# EAGLE design BOTTOM_pcb_redonda (EAGLE 9.6.2)
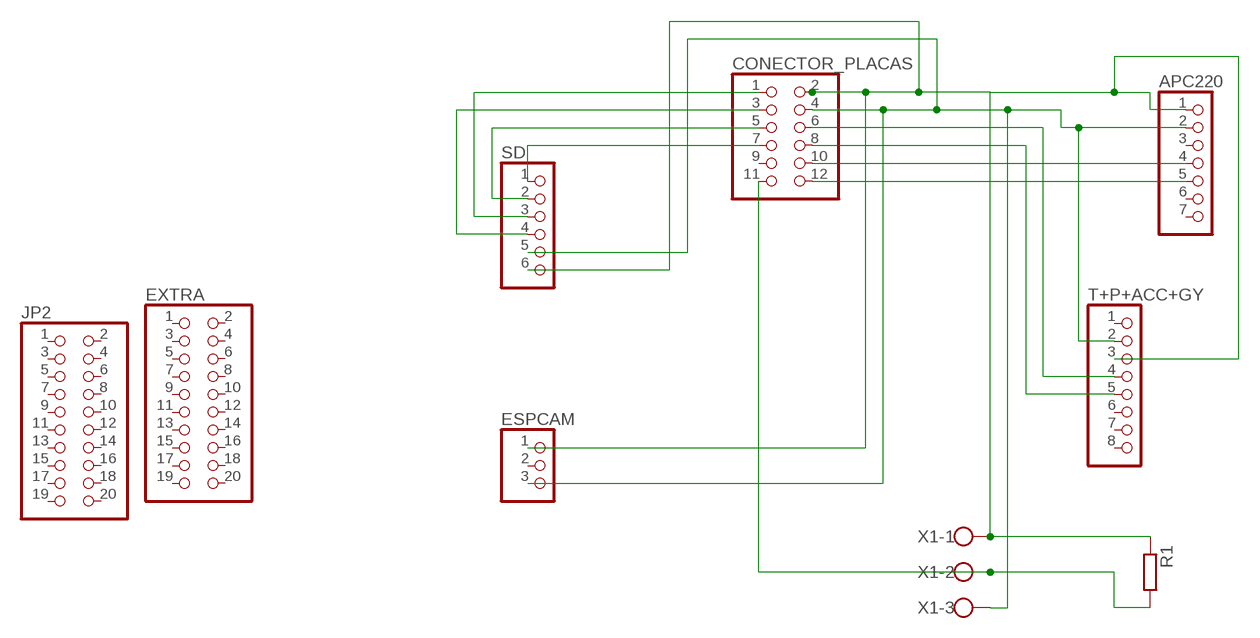
[diagram p0: schematic, sheet 1]

## Parts
APC220  PINHD-1X7  [1X07]
CONECTOR_PLACAS  PINHD-2X6  [2X06]
ESPCAM  PINHD-1X3  [1X03]
EXTRA  PINHD-2X10  [2X10]
JP2  PINHD-2X10  [2X10]
R1  R-EU_0207/10  [0207/10]
SD  PINHD-1X6  [1X06]
T+P+ACC+GY  PINHD-1X8  [1X08]
X1  W237-103  [W237-103]

## Nets
N$1: APC220.2 CONECTOR_PLACAS.4 ESPCAM.3 SD.5 T+P+ACC+GY.2 X1.3
N$2: CONECTOR_PLACAS.7 SD.1
N$3: APC220.4 CONECTOR_PLACAS.10
N$4: APC220.5 CONECTOR_PLACAS.12
N$5: CONECTOR_PLACAS.6 T+P+ACC+GY.4
N$6: CONECTOR_PLACAS.8 T+P+ACC+GY.5
N$7: APC220.1 CONECTOR_PLACAS.2 ESPCAM.1 R1.1 SD.6 T+P+ACC+GY.3 X1.1
N$8: CONECTOR_PLACAS.11 R1.2 X1.2
N$9: CONECTOR_PLACAS.5 SD.2
N$10: CONECTOR_PLACAS.1 SD.3
N$11: CONECTOR_PLACAS.3 SD.4
Unconnected: APC220.3 APC220.6 APC220.7 CONECTOR_PLACAS.9 ESPCAM.2 EXTRA.1 EXTRA.2 EXTRA.3 EXTRA.4 EXTRA.5 EXTRA.6 EXTRA.7 EXTRA.8 EXTRA.9 EXTRA.10 EXTRA.11 EXTRA.12 EXTRA.13 EXTRA.14 EXTRA.15 EXTRA.16 EXTRA.17 EXTRA.18 EXTRA.19 EXTRA.20 JP2.1 JP2.2 JP2.3 JP2.4 JP2.5 JP2.6 JP2.7 JP2.8 JP2.9 JP2.10 JP2.11 JP2.12 JP2.13 JP2.14 JP2.15 JP2.16 JP2.17 JP2.18 JP2.19 JP2.20 T+P+ACC+GY.1 T+P+ACC+GY.6 T+P+ACC+GY.7 T+P+ACC+GY.8

## Library data of the parts
APC220 = pinhead:PINHD-1X7: PIN HEADER
CONECTOR_PLACAS = pinhead:PINHD-2X6: PIN HEADER
ESPCAM = pinhead:PINHD-1X3: PIN HEADER
EXTRA JP2 = pinhead:PINHD-2X10: PIN HEADER
R1 = rcl:R-EU_: RESISTOR, European symbol; SPICEPREFIX: R
SD = pinhead:PINHD-1X6: PIN HEADER
T+P+ACC+GY = pinhead:PINHD-1X8: PIN HEADER
X1 = con-wago-500:W237-103: WAGO SCREW CLAMP; MPN: 237-103; OC_FARNELL: unknown; OC_NEWARK: 18M7116

## Board
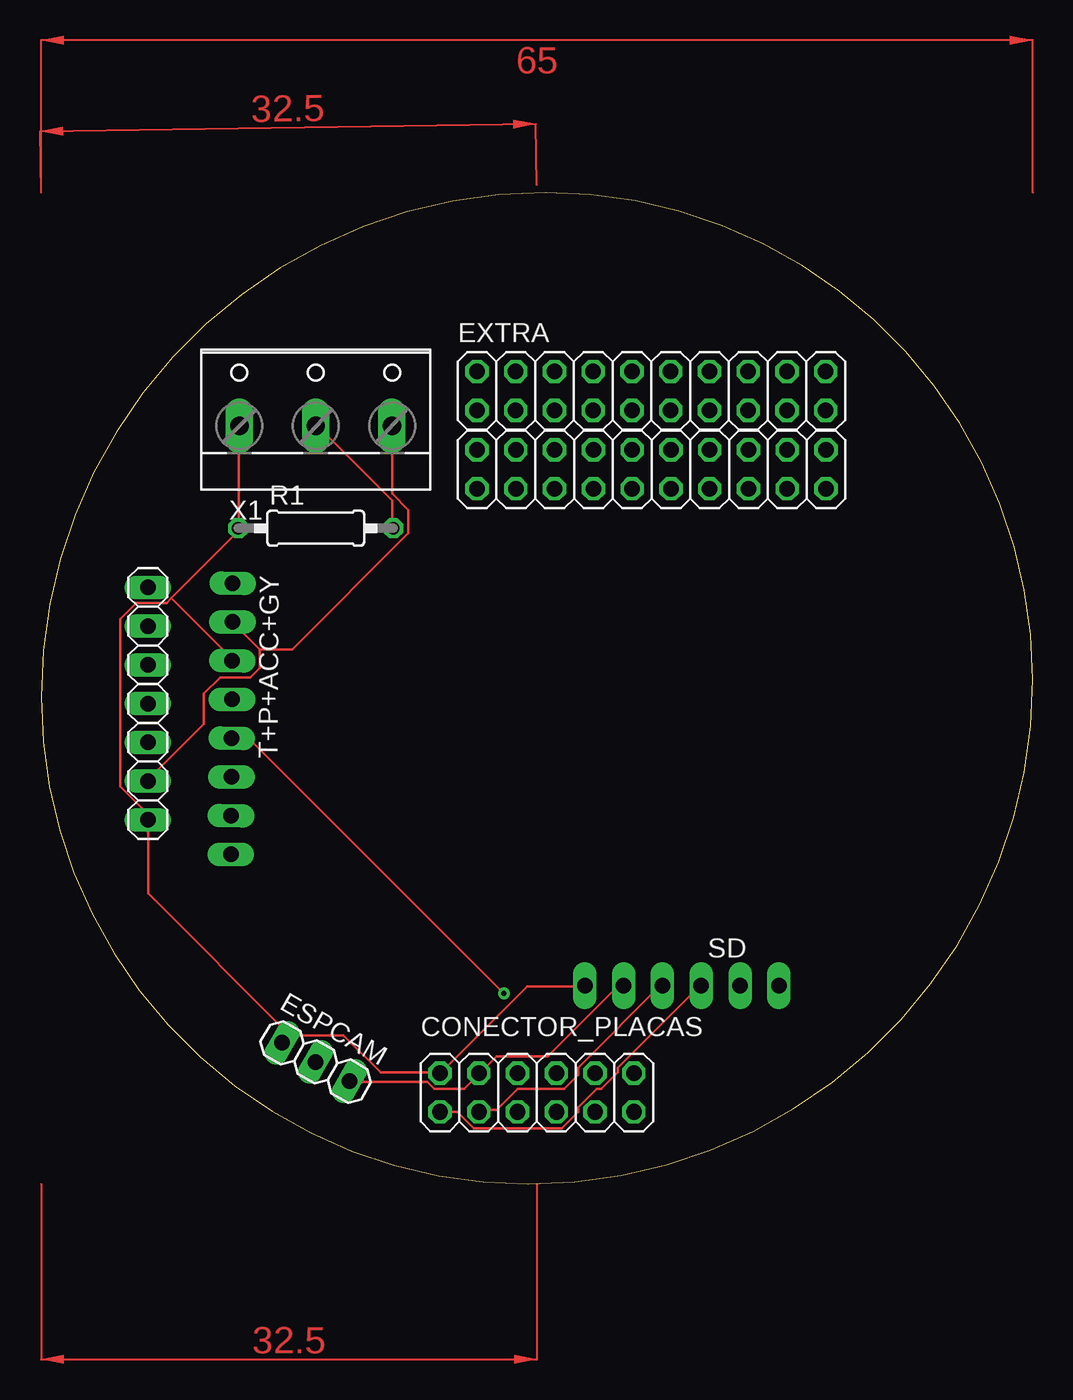
[diagram p1: board, top side]
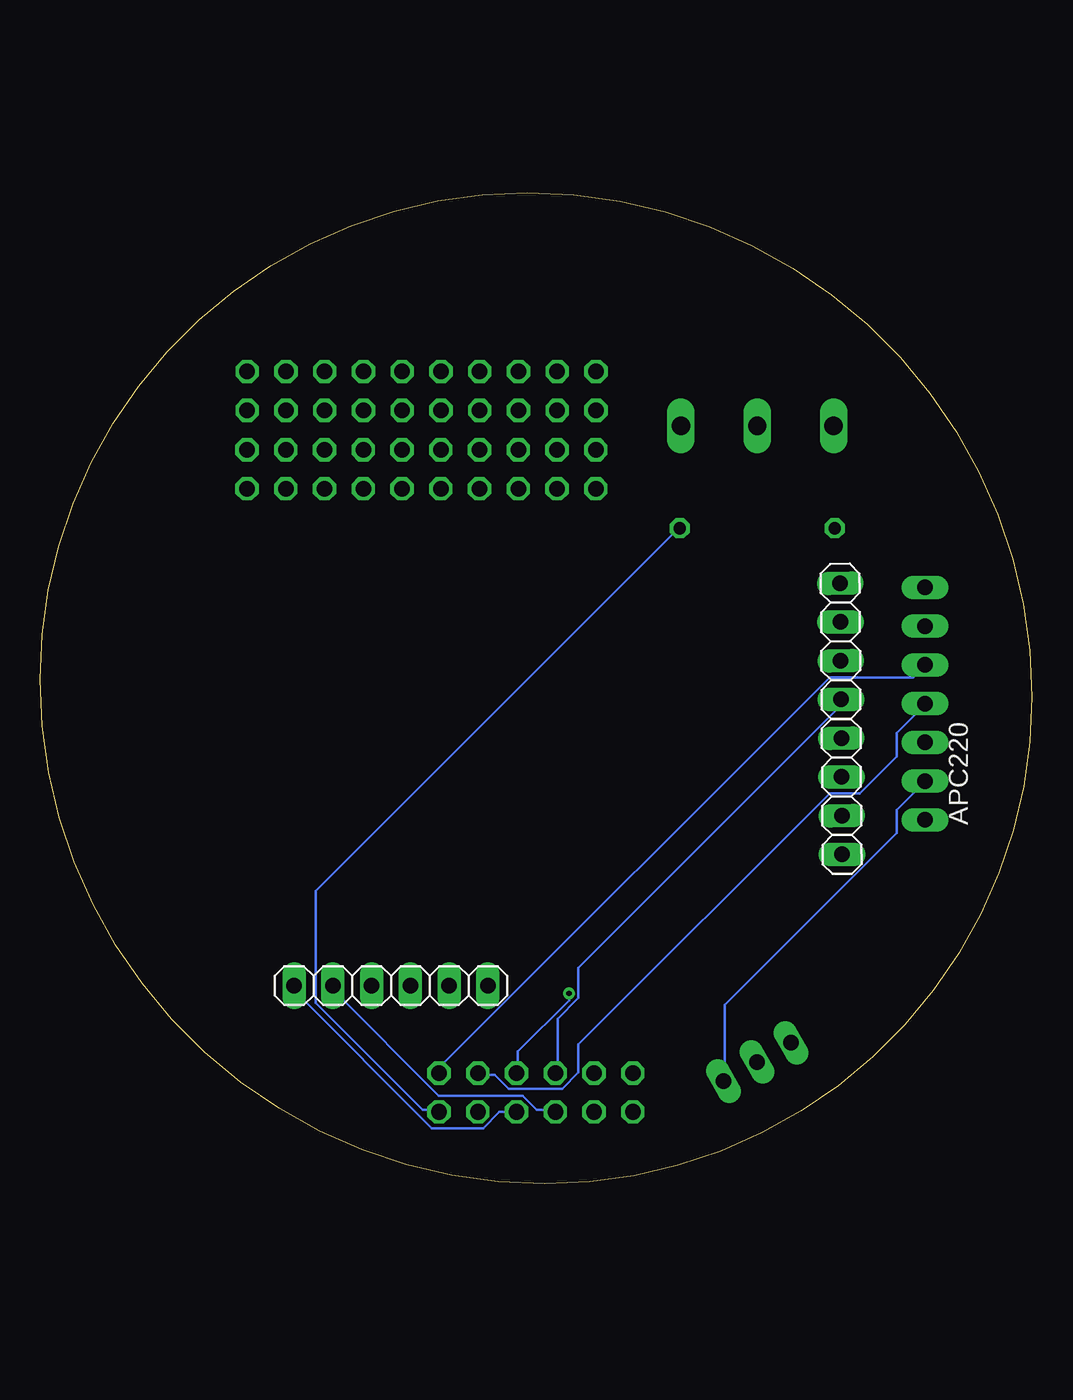
[diagram p2: board, bottom side, seen from below]

Size 65 x 65 mm. Coordinates in mm from the lower left corner, seen from the top.
Outline: 0,31.93 arc90 31.93,0 arc90 65,33.06 arc90 33.06,65 arc90 0,31.93
Copper layers (1*16): Top 0.035mm / dielectric 1.5mm / Bottom 0.035mm
Design rules "default": minimum track width 6mil, minimum drill 0.35mm, track to track 6mil, track to pad 6mil, pad to pad 6mil, via to via 6mil, smd to smd 6mil, copper to edge 40mil, drill to drill 6mil, minimum pad ring 10mil, minimum via ring 8mil, stop-mask expansion 4mil, vias tented up to drill 0mil, thermal gap 10mil

### Footprints (pad centres in the part's own frame; a part is rotated, then mirrored left to right if it is on the bottom)
1X07 = drill 1.016 long: 1 -7.62,0; 2 -5.08,0; 3 -2.54,0; 4 0,0; 5 2.54,0; 6 5.08,0; 7 7.62,0
2X06 = drill 1.016 octagon: 1 -6.35,-1.27; 2 -6.35,1.27; 3 -3.81,-1.27; 4 -3.81,1.27; 5 -1.27,-1.27; 6 -1.27,1.27; 7 1.27,-1.27; 8 1.27,1.27; 9 3.81,-1.27; 10 3.81,1.27; 11 6.35,-1.27; 12 6.35,1.27
1X03 = drill 1.016 long: 1 -2.54,0; 2 0,0; 3 2.54,0
2X10 = drill 1.016 octagon: 1 -11.43,-1.27; 2 -11.43,1.27; 3 -8.89,-1.27; 4 -8.89,1.27; 5 -6.35,-1.27; 6 -6.35,1.27; 7 -3.81,-1.27; 8 -3.81,1.27; 9 -1.27,-1.27; 10 -1.27,1.27; 11 1.27,-1.27; 12 1.27,1.27; 13 3.81,-1.27; 14 3.81,1.27; 15 6.35,-1.27; 16 6.35,1.27; 17 8.89,-1.27; 18 8.89,1.27; 19 11.43,-1.27; 20 11.43,1.27
0207/10 = drill 0.813 octagon: 1 -5.08,0; 2 5.08,0
1X06 = drill 1.016 long: 1 -6.35,0; 2 -3.81,0; 3 -1.27,0; 4 1.27,0; 5 3.81,0; 6 6.35,0
1X08 = drill 1.016 long: 1 -8.89,0; 2 -6.35,0; 3 -3.81,0; 4 -1.27,0; 5 1.27,0; 6 3.81,0; 7 6.35,0; 8 8.89,0
W237-103 = drill 1.194 long: 1 -5,-1.29; 2 0,-1.29; 3 5,-1.29

### Placement (x,y rotation side)
APC220  7,31.5 90 top
CONECTOR_PLACAS  32.5,6 0 top
ESPCAM  18,8 330.3 top
EXTRA  40,52 0 top
JP2  40.01,46.86 0 top
R1  18,43 0 top
SD  42,13 0 bottom
T+P+ACC+GY  12.5,30.5 270.4 bottom
X1  18,51 0 top

### Tracks (layer width: path | path; a pad name or v marks a point on that pad's centre or on a via)
N$1
  Top 0.152: X1.3 23.01,49.68 23.01,45.26 24.08,44.2 24.08,42.67 16.46,35.05 14.33,35.05 | ESPCAM.3 20.27,6.71 25.3,6.71 25.76,6.25 27.74,6.25 28.65,7.16 CONECTOR_PLACAS.4 28.8,7.32 29.87,8.38 33.22,8.38 37.8,12.95 38.1,12.95 SD.5 | 14.33,35.05 14.33,33.83 13.72,33.22 11.73,33.22 10.67,32.16 10.67,30.18 7.01,26.52 APC220.2 | 14.33,35.05 12.65,36.73 T+P+ACC+GY.2
  Bottom 0.152: ESPCAM.3 20.12,6.86 20.12,11.73 8.84,23.01 8.84,24.54 7.01,26.36 APC220.2
N$2
  Bottom 0.152: CONECTOR_PLACAS.7 33.83,4.72 34.9,4.72 35.97,3.66 39.32,3.66 48.31,12.65 48.31,12.95 SD.1
N$3
  Bottom 0.152: CONECTOR_PLACAS.10 36.27,7.16 35.2,7.16 34.29,6.25 30.79,6.25 29.72,7.32 29.72,9.14 13.26,25.6 11.28,25.6 8.84,28.04 8.84,29.57 7.01,31.39 APC220.4
N$4
  Bottom 0.152: CONECTOR_PLACAS.12 38.71,7.32 38.71,7.77 13.26,33.22 7.77,33.22 7.01,33.98 APC220.5
N$5
  Bottom 0.152: CONECTOR_PLACAS.6 31.09,7.32 31.09,10.82 29.72,12.19 29.72,14.17 12.65,31.24 12.65,31.7 T+P+ACC+GY.4
N$6  (via drill 0.35)
  Top 0.152: v30.33,12.5 13.72,29.11 12.5,29.11 T+P+ACC+GY.5
  Bottom 0.152: v30.33,12.5 30.33,12.04 33.68,8.69 33.68,7.32 CONECTOR_PLACAS.8
N$7
  Top 0.152: X1.1 12.95,49.68 12.95,43.13 R1.1 12.8,42.98 12.8,42.67 8.53,38.41 | 16.31,9.75 19.81,9.75 22.25,7.32 26.06,7.32 CONECTOR_PLACAS.2 26.21,7.32 31.85,12.95 35.51,12.95 SD.6 | 16.31,9.75 15.85,9.3 ESPCAM.1 16.31,9.75 | 8.53,38.41 8.23,38.1 6.25,38.1 5.18,37.03 5.18,26.06 6.86,24.38 6.86,23.93 APC220.1 7.01,23.77 7.01,19.05 16.31,9.75 | 8.53,38.41 12.5,34.44 T+P+ACC+GY.3
  Bottom 0.152: 15.7,9.3 ESPCAM.1 | 7.01,23.93 APC220.1
N$8
  Top 0.152: R1.2 23.01,43.13 23.01,44.81 18.14,49.68 X1.2
  Bottom 0.152: CONECTOR_PLACAS.11 38.86,4.88 39.93,4.88 46.94,11.89 46.94,19.2 23.16,42.98 R1.2
N$9
  Bottom 0.152: CONECTOR_PLACAS.5 31.24,4.88 32.46,4.88 33.38,5.79 38.86,5.79 45.72,12.65 45.72,12.95 SD.2
N$10
  Top 0.152: CONECTOR_PLACAS.1 26.21,4.72 27.28,4.72 28.35,3.66 34.14,3.66 35.2,4.72 35.2,5.03 36.42,6.25 36.73,6.25 37.8,7.32 37.8,7.62 43.13,12.95 SD.3
N$11
  Top 0.152: CONECTOR_PLACAS.3 28.8,4.88 29.87,4.88 31.24,6.25 34.29,6.25 35.2,7.16 35.2,7.62 40.69,13.11 SD.4
(copper drawn outside any net)
  shapes: Top area x3